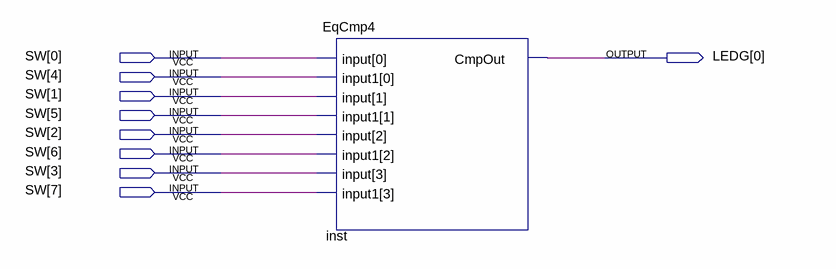
[diagram p0: schematic sheet]
// Quartus schematic EqCmpDemo.bdf as structural Verilog: 1 symbols, 9 pins
module EqCmpDemo (
  input  [7:0] SW,
  output [0:0] LEDG
);

  EqCmp4 inst (.\input (SW[3:0]), .input1(SW[7:4]), .CmpOut(LEDG[0]));
endmodule
